# EAGLE design receiver (EAGLE 8.7.0)
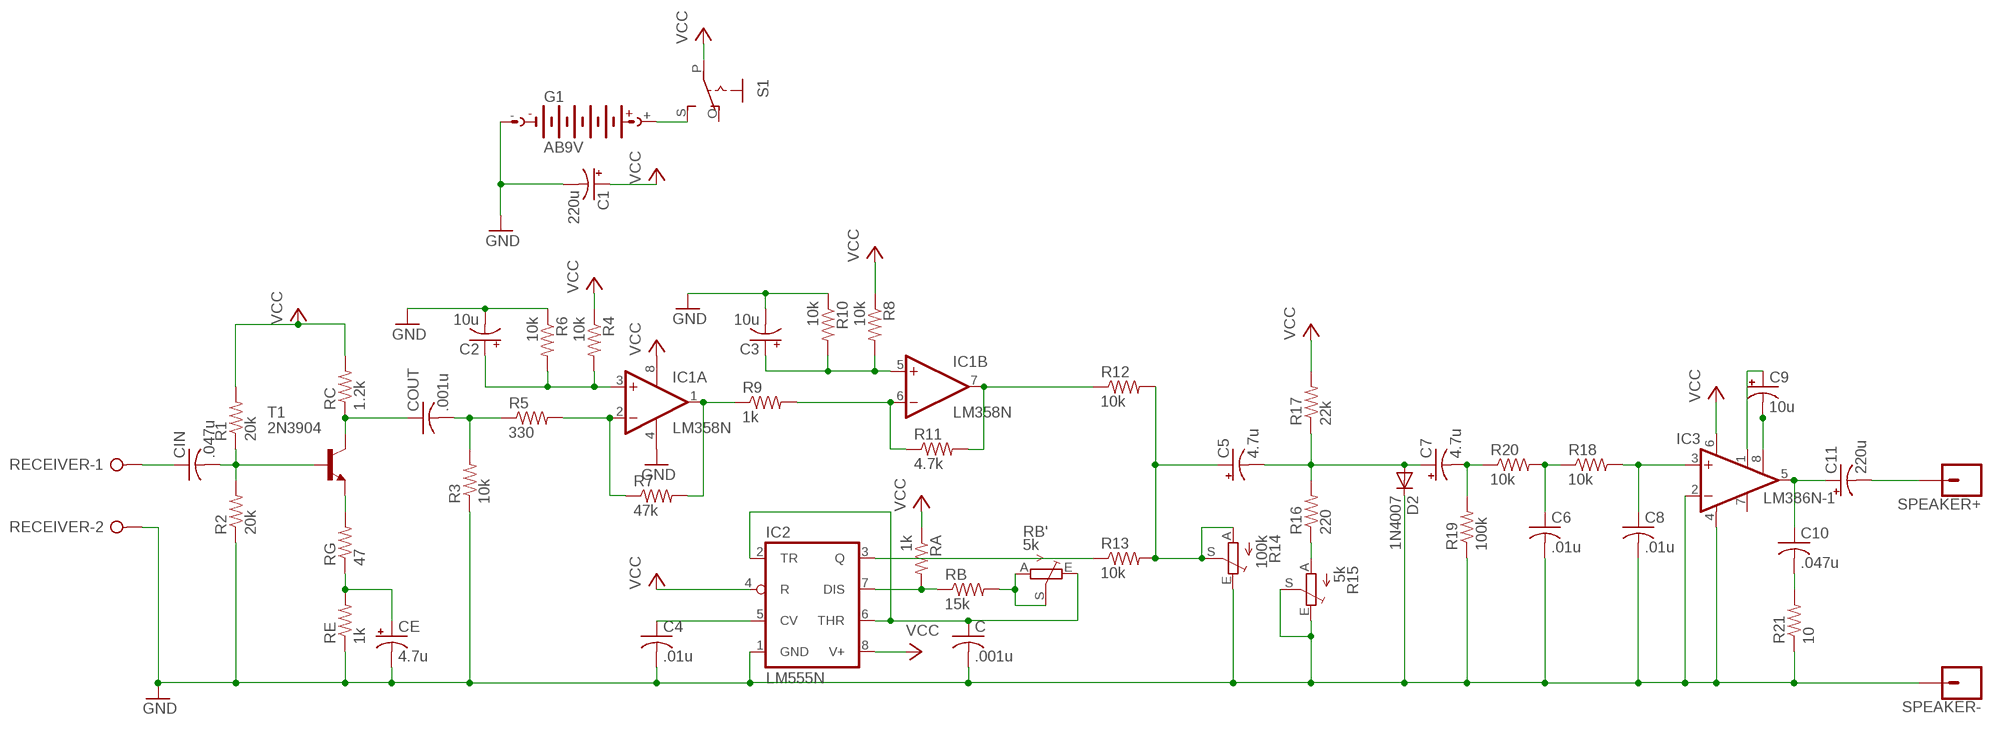
[diagram p0: schematic, sheet 1]

## Parts
C  .001u  C-US050-024X044  [C050-024X044]
C1  220u  CPOL-USB45181B  [B45181B]
C2  10u  CPOL-USB45181B  [B45181B]
C3  10u  CPOL-USB45181B  [B45181B]
C4  .01u  C-US050-024X044  [C050-024X044]
C5  4.7u  CPOL-USB45181B  [B45181B]
C6  .01u  C-US050-024X044  [C050-024X044]
C7  4.7u  CPOL-USB45181B  [B45181B]
C8  .01u  C-US050-024X044  [C050-024X044]
C9  10u  CPOL-USB45181B  [B45181B]
C10  .047u  C-US050-024X044  [C050-024X044]
C11  220u  CPOL-USB45181B  [B45181B]
CE  4.7u  CPOL-USB45181B  [B45181B]
CIN  .047u  C-US050-024X044  [C050-024X044]
COUT  .001u  C-US050-024X044  [C050-024X044]
D2  1N4007  1N4004  [DO41-10]
G1  AB9V  [AB9V]
IC1  LM358N  [DIL08]
IC2  LM555N  [DIL08-ROUND]
IC3  LM386N-1  [DIL08]
R1  20k  R-US_0207/10  [0207/10]
R2  20k  R-US_0207/10  [0207/10]
R3  10k  R-US_0207/10  [0207/10]
R4  10k  R-US_0207/10  [0207/10]
R5  330  R-US_0207/10  [0207/10]
R6  10k  R-US_0207/10  [0207/10]
R7  47k  R-US_0207/10  [0207/10]
R8  10k  R-US_0207/10  [0207/10]
R9  1k  R-US_0207/10  [0207/10]
R10  10k  R-US_0207/10  [0207/10]
R11  4.7k  R-US_0207/10  [0207/10]
R12  10k  R-US_0207/10  [0207/10]
R13  10k  R-US_0207/10  [0207/10]
R14  100k  TRIM_EU-B25P  [B25P]
R15  5k  TRIM_EU-B25P  [B25P]
R16  220  R-US_0207/10  [0207/10]
R17  22k  R-US_0207/10  [0207/10]
R18  10k  R-US_0207/10  [0207/10]
R19  100k  R-US_0207/10  [0207/10]
R20  10k  R-US_0207/10  [0207/10]
R21  10  R-US_0207/10  [0207/10]
RA  1k  R-US_0207/10  [0207/10]
RB  15k  R-US_0207/10  [0207/10]
RB'  5k  TRIM_EU-B25P  [B25P]
RC  1.2k  R-US_0207/10  [0207/10]
RE  1k  R-US_0207/10  [0207/10]
RECEIVER  W237-02P  [W237-132]
RG  47  R-US_0207/10  [0207/10]
S1  EG1218S  [EG1218]
SPEAKER+  CONN_01  [1X01]
SPEAKER-  CONN_01  [1X01]
T1  2N3904  [TO92]

## Nets
GND: C1.- C2.- C3.- C4.2 C6.2 C8.2 C.2 CE.- D2.C G1.- IC1.4(P:V-) IC2.1(GND) IC3.2(-IN) IC3.4(GND) R2.1 R3.1 R6.1 R10.1 R14.E R15.E R15.S R19.1 R21.1 RE.1 RECEIVER.2 SPEAKER-.1
N$1: CIN.1 RECEIVER.1
N$2: CIN.2 R1.1 R2.2 T1.2(B)
N$3: COUT.2 R3.2 R5.1
N$4: COUT.1 RC.1 T1.1(C)
N$5: RG.2 T1.3(E)
N$6: CE.+ RE.2 RG.1
N$7: IC1.2(A:-IN) R5.2 R7.1
N$8: C2.+ IC1.3(A:+IN) R4.2 R6.2
N$9: C4.1 IC2.5(CV)
N$10: IC1.1(A:OUT) R7.2 R9.1
N$11: IC1.6(B:-IN) R9.2 R11.1
N$12: C.1 IC2.2(TR) IC2.6(THR) RB'.E
N$13: IC1.7(B:OUT) R11.2 R12.1
N$14: C3.+ IC1.5(B:+IN) R8.2 R10.2
N$15: IC2.7(DIS) RA.2 RB.1
N$16: RB'.A RB'.S RB.2
N$17: IC2.3(Q) R13.1
N$18: C5.+ R12.2 R13.2 R14.A R14.S
N$19: R15.A R16.1
N$20: C5.- C7.+ D2.A R16.2 R17.1
N$21: C11.- SPEAKER+.1
N$22: C7.- R19.2 R20.1
N$23: C6.1 R18.1 R20.2
N$24: C8.1 IC3.3(+IN) R18.2
N$25: C9.- IC3.8(GAIN)
N$26: C9.+ IC3.1(GAIN)
N$27: C10.1 C11.+ IC3.5(OUT)
N$28: C10.2 R21.2
N$30: G1.+ S1.S
VCC: C1.+ IC1.8(P:V+) IC2.4(R) IC2.8(V+) IC3.6(VS) R1.2 R4.1 R8.1 R17.2 RA.1 RC.2 S1.P
Unconnected: IC3.7(BYPASS) S1.O

## Library data of the parts
C C4 C6 C8 C10 CIN COUT = rcl:C-US: CAPACITOR, American symbol; SPICEPREFIX: C
C1-C3 C5 C7 C9 C11 CE = rcl:CPOL-US: POLARIZED CAPACITOR, American symbol; SPICEPREFIX: C
D2 = diode:1N4004: DIODE general purpose rectifier, 1 A
G1 = battery:AB9V: 9-V BATTERY CLIP
IC1 = linear:LM358: OP AMP also LM158; LM258; LM2904 Source: http://cache.national.com/ds/LM/LM158.pdf
IC2 = adafruit:*555: TIMER Changed DIP package to have round (not oval) pin pads http://www.ladyada.net/library/pcb/eaglelibrary.html
IC3 = linear:LM386?-*: Low Voltage Audio Power Amplifier Source: http://cache.national.com/ds/LM/LM386.pdf
R1-R13 R16-R21 RA RB RC RE RG = rcl:R-US_: RESISTOR, American symbol; SPICEPREFIX: R
R14 R15 RB' = pot:TRIM_EU-: POTENTIOMETER
RECEIVER = con-wago-508:W237-02P: WAGO SREW CLAMP; OC_FARNELL: unknown; OC_NEWARK: unknown
S1 = adafruit:EG1218: SLIDING SWITCH 0.1" spacing through hole, vertical SPDT slide switch http://www.ladyada.net/library/pcb/eaglelibrary.html
SPEAKER+ SPEAKER- = SparkFun-Connectors:CONN_01: Single connection point. Often used as Generic Header-pin footprint for 0.1 inch spaced/style header connections On any of the 0.1 inch spaced packages, you can populate with these: Break Away Headers - Straight <https://www.sparkfun.com/products/116> (PRT-00116) Break Away Male Headers - Right Angle <https://www.sparkfun.com/products/553> (PRT-00553) Female Headers <https://www.sparkfun.com/products/115> (PRT-00115) Break Away Headers - Machine Pin <https://www.sparkfun.com/products/117> (PRT-00117) Break Away Female Headers - Swiss Machine Pin <https://www.sparkfun.com/products/743> (PRT-00743) This device is also useful as a general connection point to wire up your design to another part of your project. Our various solder wires solder well into these plated through hole pads. Hook-Up Wire - Assortment (Stranded, 22 AWG) <https://www.sparkfun.com/products/11375> (PRT-11375) Hook-Up Wire - Assortment (Solid Core, 22 AWG) <https://www.sparkfun.com/products/11367> (PRT-11367) View the entire wire category on our website here <https://www.sparkfun.com/categories/141> Special notes: SMTSO-256-ET is a "flush mount" nut for a 4-40 screw. We mostly use this on specialty testbeds; it is a nice way to connect hardware to your PCB at an adjustable hieght. Also note, the SNAP packages are for using a snappable style connector. We sell a baggie of snaps and they are also used on two LilyPad designs: Snap Assortment - 30 pack (male and female) <https://www.sparkfun.com/products/11347> (DEV-11347) LilyPad Arduino SimpleSnap <https://www.sparkfun.com/products/10941> (DEV-10941) LilyPad SimpleSnap Protoboard <https://www.sparkfun.com/products/10940> (DEV-10940)
T1 = transistor:2N3904: NPN TRANSISTOR

## Board
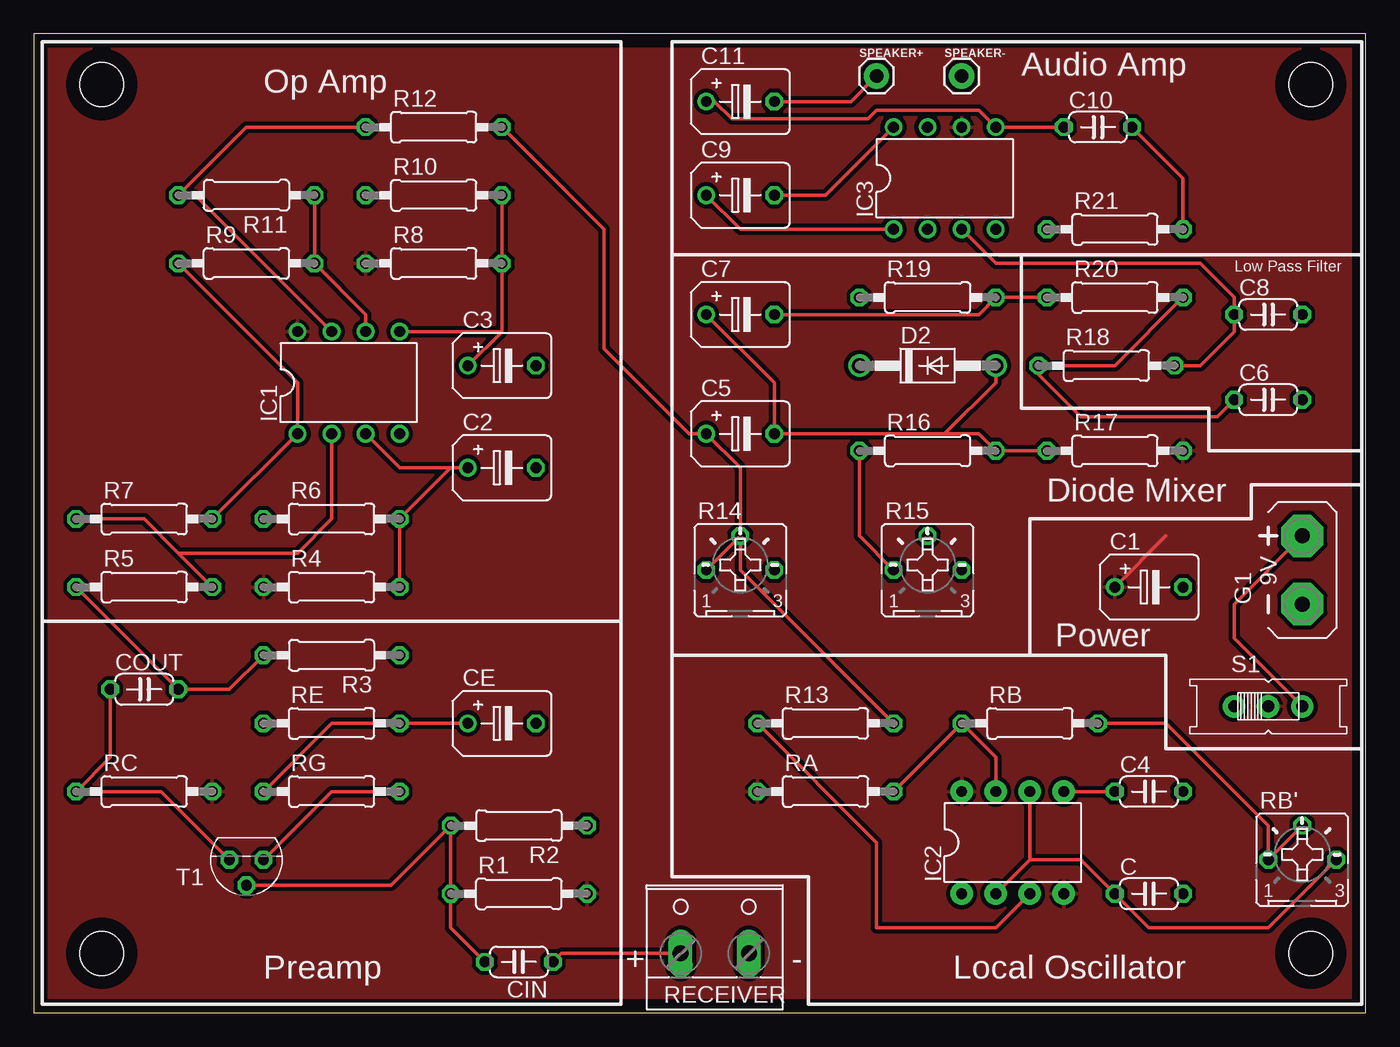
[diagram p1: board, top side]
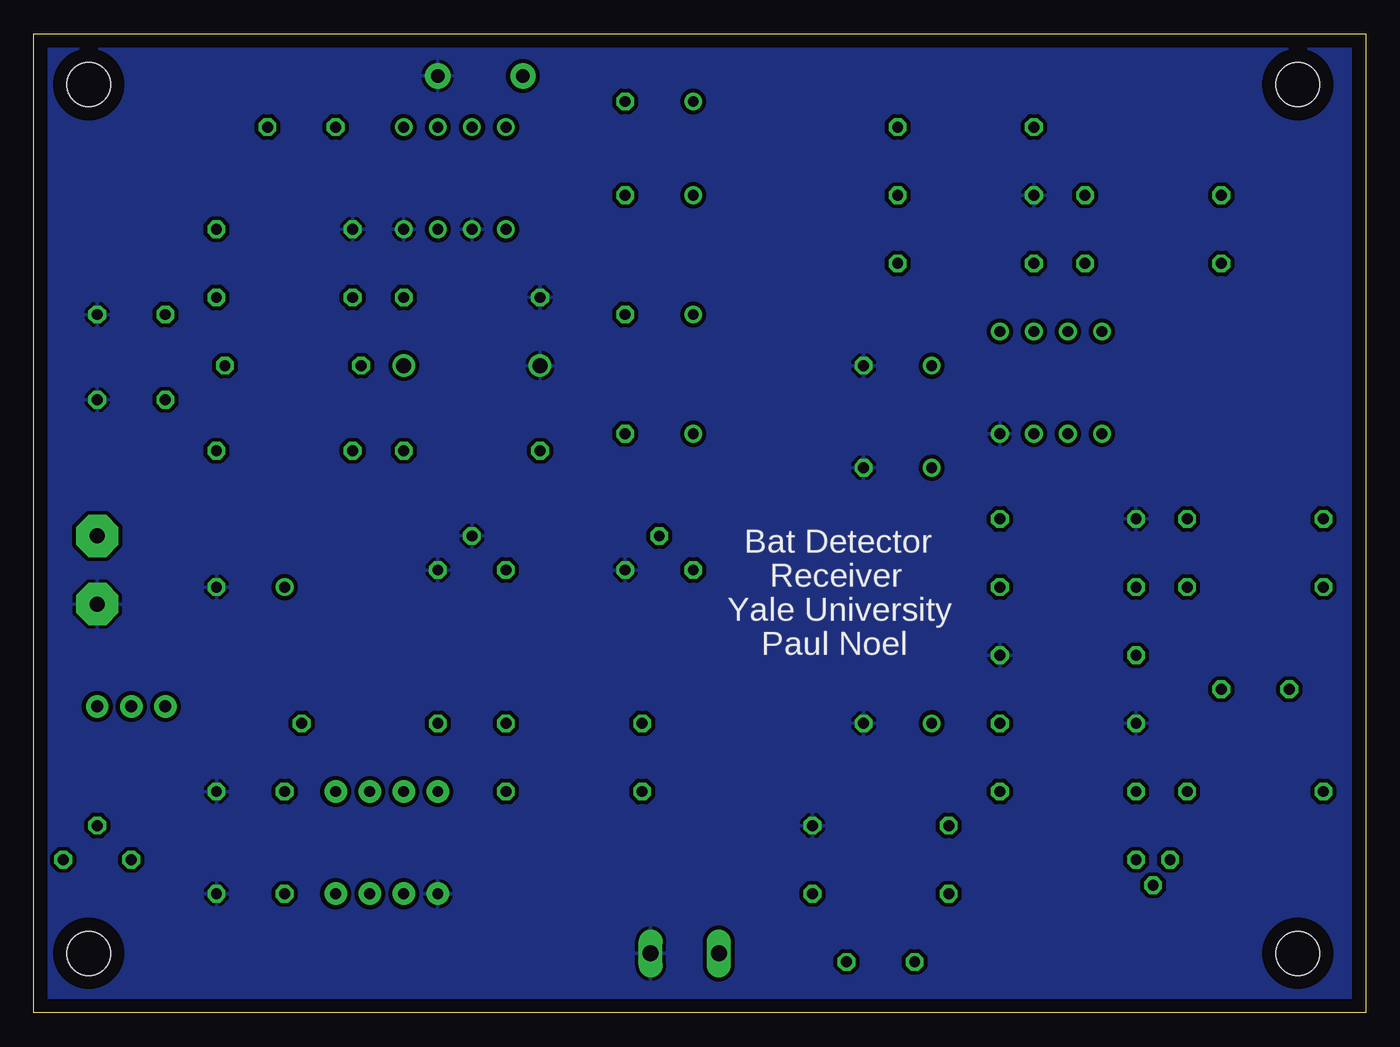
[diagram p2: board, bottom side, seen from below]

Size 99.36 x 73.02 mm. Coordinates in mm from the lower left corner, seen from the top.
Outline: 0,0 99.36,0 99.36,73.02 0,73.02 0,0
Copper layers (1*16): Top 0.035mm / dielectric 1.5mm / Bottom 0.035mm
Design rules "default": minimum track width 6mil, minimum drill 0.35mm, track to track 6mil, track to pad 6mil, pad to pad 6mil, via to via 6mil, smd to smd 6mil, copper to edge 40mil, drill to drill 6mil, minimum pad ring 10mil, minimum via ring 8mil, stop-mask expansion 4mil, vias tented up to drill 0mil, thermal gap 10mil
Holes 3.28 mm at 5.08,4.45 5.08,69.22 95.25,69.22 95.25,4.45

### Footprints (pad centres in the part's own frame; a part is rotated, then mirrored left to right if it is on the bottom)
C050-024X044 = drill 0.813 octagon: 1 -2.54,0; 2 2.54,0
B45181B = drill 0.813: + -2.54,0 | drill 0.813 octagon: - 2.54,0
DO41-10 = drill 1.118: A 5.08,0; C -5.08,0
AB9V = drill 1.118 pad 3.15 octagon: + 0,2.54; - 0,-2.54
DIL08 = drill 0.813 pad 1.27: 1 -3.81,-3.81; 2 -1.27,-3.81; 3 1.27,-3.81; 4 3.81,-3.81; 5 3.81,3.81; 6 1.27,3.81; 7 -1.27,3.81; 8 -3.81,3.81
DIL08-ROUND = drill 0.813 pad 1.676: 1 -3.81,-3.81; 2 -1.27,-3.81; 3 1.27,-3.81; 4 3.81,-3.81; 5 3.81,3.81; 6 1.27,3.81; 7 -1.27,3.81; 8 -3.81,3.81
0207/10 = drill 0.813 octagon: 1 -5.08,0; 2 5.08,0
B25P = drill 0.813 octagon: A -2.54,0; E 2.54,0; S 0,2.54
W237-132 = drill 1.194 long: 1 -2.54,-0.635; 2 2.54,-0.635
EG1218 = drill 0.9 pad 1.676: O -2.54,0; P 0,0; S 2.54,0
1X01 = drill 1.016 pad 1.88: 1 0,0
TO92 = drill 0.813 octagon: 1 1.27,0; 2 0,1.905; 3 -1.27,0

### Placement (x,y rotation side)
C  83.18,8.89 0 top
C1  83.18,31.75 0 top
C2  34.93,40.64 0 top
C3  34.93,48.26 0 top
C4  83.18,16.51 0 top
C5  52.71,43.18 0 top
C6  92.07,45.72 0 top
C7  52.71,52.07 0 top
C8  92.07,52.07 0 top
C9  52.71,60.96 0 top
C10  79.38,66.04 0 top
C11  52.71,67.95 0 top
CE  34.93,21.59 0 top
CIN  36.2,3.81 180 top
COUT  8.26,24.13 0 top
D2  66.67,48.26 0 top
G1  94.61,33.02 0 top
IC1  23.49,46.99 0 top
IC2  73.02,12.7 0 top
IC3  67.94,62.23 0 top
R1  36.2,8.89 0 top
R2  36.2,13.97 180 top
R3  22.22,26.67 180 top
R4  22.22,31.75 0 top
R5  8.26,31.75 0 top
R6  22.22,36.83 0 top
R7  8.26,36.83 0 top
R8  29.84,55.88 0 top
R9  15.88,55.88 0 top
R10  29.84,60.96 0 top
R11  15.88,60.96 180 top
R12  29.84,66.04 0 top
R13  59.05,21.59 0 top
R14  52.71,33.02 0 top
R15  66.67,33.02 0 top
R16  66.67,41.91 0 top
R17  80.64,41.91 0 top
R18  80.01,48.26 0 top
R19  66.67,53.34 0 top
R20  80.64,53.34 0 top
R21  80.64,58.42 0 top
RA  59.05,16.51 0 top
RB  74.3,21.59 0 top
RB'  94.61,11.43 0 top
RC  8.26,16.51 0 top
RE  22.22,21.59 0 top
RECEIVER  50.8,5.08 0 top
RG  22.22,16.51 0 top
S1  92.07,22.86 0 top
SPEAKER+  62.87,69.85 0 top
SPEAKER-  69.21,69.85 0 top
T1  15.88,11.43 180 top

### Tracks (layer width: path | path; a pad name or v marks a point on that pad's centre or on a via)
GND
  pour Bottom (isolate 0.305): -4.45,76.2 103.5,76.2 103.5,-3.81 -4.45,-3.81
N$1
  Top 0.254: CIN.1 39.37,4.45 RECEIVER.1
N$2
  Top 0.254: T1.2 26.67,9.53 R2.2 R1.1 31.11,6.35 CIN.2
N$3
  Top 0.254: R5.1 COUT.2 14.61,24.13 R3.2
N$4
  Top 0.254: COUT.1 5.71,19.05 RC.1 9.53,16.51 T1.1
N$5
  Top 0.254: T1.3 22.22,16.51 RG.2
N$6
  Top 0.254: RG.1 22.22,21.59 RE.2 CE.+
N$7
  Top 0.254: R7.1 8.26,36.83 10.79,34.29 | 10.79,34.29 R5.2 | IC1.2 22.22,36.83 19.68,34.29 10.79,34.29
N$8
  Top 0.254: R4.2 R6.2 31.11,40.64 | 31.11,40.64 C2.+ | 31.11,40.64 27.3,40.64 IC1.3
N$9
  Top 0.254: C4.1 IC2.5
N$10
  Top 0.254: R7.2 IC1.1 19.68,46.99 R9.1
N$11
  Top 0.254: IC1.6 24.76,52.07 R9.2 R11.1
N$12
  Top 0.254: IC2.2 74.3,11.43 | 74.3,11.43 IC2.6 | 74.3,11.43 78.1,11.43 C.1 83.18,6.35 92.07,6.35 RB'.E
N$13
  Top 0.254: IC1.7 12.06,60.96 R11.2 15.88,66.04 R12.1
N$14
  Top 0.254: C3.+ 34.93,50.8 | 34.93,50.8 R8.2 R10.2 | IC1.5 34.93,50.8
N$15
  Top 0.254: IC2.7 71.75,19.05 RB.1 RA.2
N$16
  Top 0.254: RB'.S RB'.A 92.07,13.97 84.45,21.59 RB.2
N$17
  Top 0.254: R13.1 62.87,12.7 62.87,6.35 71.75,6.35 IC2.3
N$18
  Top 0.254: R12.2 42.55,58.42 42.55,49.53 48.9,43.18 C5.+ 52.71,40.64 R14.S | R14.S R14.A | R14.S 52.71,33.02 R13.2
N$19
  Top 0.254: R16.1 61.59,35.56 R15.A
N$20
  Top 0.254: C7.+ 55.25,46.99 C5.- 67.94,43.18 | 67.94,43.18 70.48,43.18 R16.2 R17.1 | D2.A 71.75,46.99 67.94,43.18
N$21
  Top 0.254: C11.- 60.96,67.95 SPEAKER+.1
N$22
  Top 0.254: R20.1 R19.2 70.48,52.07 C7.-
N$23
  Top 0.254: C6.1 88.27,44.45 78.1,44.45 74.93,47.62 R18.1 80.64,48.26 R20.2
N$24
  Top 0.254: IC3.3 71.75,55.88 86.99,55.88 89.53,53.34 C8.1 89.53,50.8 86.99,48.26 R18.2
N$25
  Top 0.254: C9.- 59.05,60.96 IC3.8
N$26
  Top 0.254: C9.+ 52.71,58.42 IC3.1
N$27
  Top 0.254: C10.1 IC3.5 70.48,67.31 62.87,67.31 62.23,66.67 52.07,66.67 50.8,67.95 C11.+
N$28
  Top 0.254: C10.2 85.72,62.23 R21.2
N$30
  Top 0.254: S1.S 89.53,27.94 89.53,30.48 G1.+
VCC
  Top 0.254: C1.+ 84.45,35.56
  pour Top (isolate 0.305): -8.26,80.01 -8.26,-6.35 107.31,-6.35 108.58,-6.35 108.58,80.01

### Text on the board
tPlace: Audio Amp | Op Amp | Low Pass Filter | Diode Mixer | Power | Preamp | + | - | Local Oscillator
bPlace: Bat Detector | Receiver | Yale University | Paul Noel